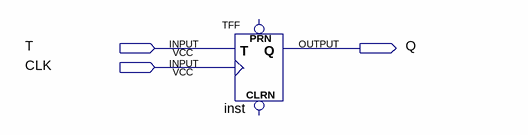
[diagram p0: schematic sheet]
// Quartus schematic TFF_test.bdf as structural Verilog: 1 symbols, 3 pins
module TFF_test (
  input  T,
  input  CLK,
  output Q
);

  TFF inst (.T(T), .CLK(CLK), .Q(Q));  // open: PRN, CLRN
endmodule
